# EAGLE design lcdpanel (EAGLE 6.4)
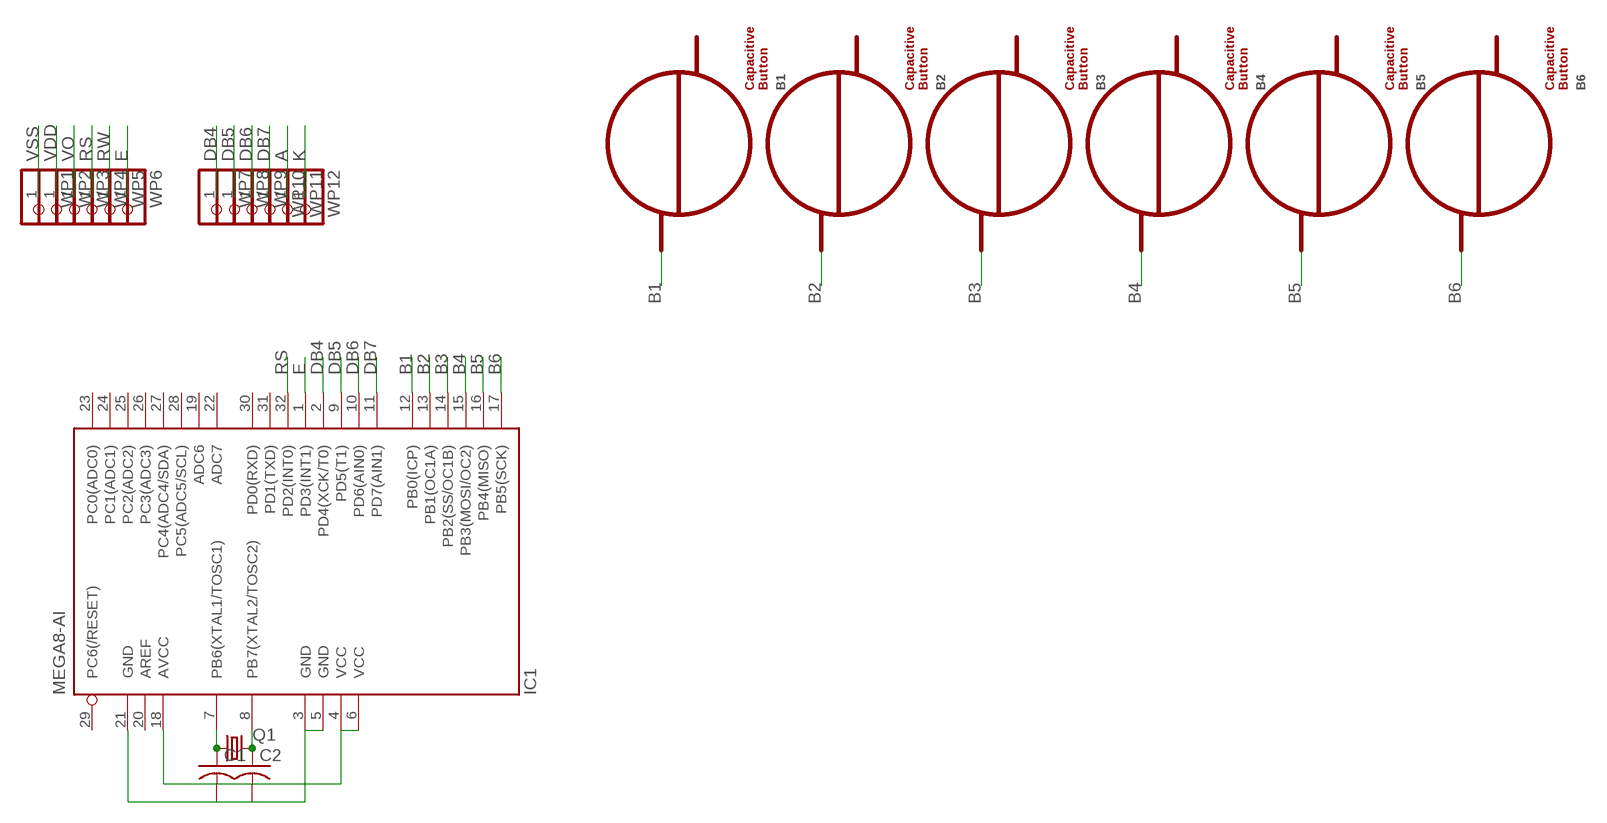
[diagram p0: schematic, sheet 1]

## Parts
B1  BUTTON_ACTIVE_DUAL  [BUTTON_ACTIVE_DUAL_10MM]
B2  BUTTON_ACTIVE_DUAL  [BUTTON_ACTIVE_DUAL_10MM]
B3  BUTTON_ACTIVE_DUAL  [BUTTON_ACTIVE_DUAL_10MM]
B4  BUTTON_ACTIVE_DUAL  [BUTTON_ACTIVE_DUAL_10MM]
B5  BUTTON_ACTIVE_DUAL  [BUTTON_ACTIVE_DUAL_10MM]
B6  BUTTON_ACTIVE_DUAL  [BUTTON_ACTIVE_DUAL_10MM]
C1  C-USC1206  [C1206]
C2  C-USC1206  [C1206]
IC1  MEGA8-AI  [TQFP32-08]
Q1  CRYSTALHC49UP  [HC49UP]
WP1  WPAD-1-0805  [WPAD-1-0805]
WP2  WPAD-1-0805  [WPAD-1-0805]
WP3  WPAD-1-0805  [WPAD-1-0805]
WP4  WPAD-1-0805  [WPAD-1-0805]
WP5  WPAD-1-0805  [WPAD-1-0805]
WP6  WPAD-1-0805  [WPAD-1-0805]
WP7  WPAD-1-0805  [WPAD-1-0805]
WP8  WPAD-1-0805  [WPAD-1-0805]
WP9  WPAD-1-0805  [WPAD-1-0805]
WP10  WPAD-1-0805  [WPAD-1-0805]
WP11  WPAD-1-0805  [WPAD-1-0805]
WP12  WPAD-1-0805  [WPAD-1-0805]

## Nets
A: WP11.1
B1: B1.Q2 IC1.12(PB0(ICP))
B2: B2.Q2 IC1.13(PB1(OC1A))
B3: B3.Q2 IC1.14(PB2(SS/OC1B))
B4: B4.Q2 IC1.15(PB3(MOSI/OC2))
B5: B5.Q2 IC1.16(PB4(MISO))
B6: B6.Q2 IC1.17(PB5(SCK))
DB4: IC1.2(PD4(XCK/T0)) WP7.1
DB5: IC1.9(PD5(T1)) WP8.1
DB6: IC1.10(PD6(AIN0)) WP9.1
DB7: IC1.11(PD7(AIN1)) WP10.1
E: IC1.1(PD3(INT1)) WP6.1
K: WP12.1
N$1: C2.1 IC1.8(PB7(XTAL2/TOSC2)) Q1.2
N$2: C1.1 IC1.7(PB6(XTAL1/TOSC1)) Q1.1
N$3: C1.2 C2.2 IC1.3(GND) IC1.5(GND) IC1.21(GND)
N$4: IC1.4(VCC) IC1.6(VCC) IC1.18(AVCC)
RS: IC1.32(PD2(INT0)) WP4.1
RW: WP5.1
VDD: WP2.1
VO: WP3.1
VSS: WP1.1
Unconnected: B1.Q1 B2.Q1 B3.Q1 B4.Q1 B5.Q1 B6.Q1 IC1.19(ADC6) IC1.20(AREF) IC1.22(ADC7) IC1.23(PC0(ADC0)) IC1.24(PC1(ADC1)) IC1.25(PC2(ADC2)) IC1.26(PC3(ADC3)) IC1.27(PC4(ADC4/SDA)) IC1.28(PC5(ADC5/SCL)) IC1.29(PC6(/RESET)) IC1.30(PD0(RXD)) IC1.31(PD1(TXD))

## Library data of the parts
B1-B6 = PatternAgents-TouchWidgets:BUTTON_ACTIVE_DUAL: Button, Active Capacitive/Touch Sensing Type, Dual Source : http://www.PatternAgents.com Github : https://github.com/PatternAgents License : http://creativecommons.org/licenses/by-sa/3.1/ (Creative Commons 3.1) THIS SOFTWARE IS PROVIDED BY THE CONTRIBUTORS "AS IS" AND WITHOUT ANY EXPRESS OR IMPLIED WARRANTIES, INCLUDING, BUT NOT LIMITED TO, THE IMPLIED WARRANTIES OF MERCHANTABILITY AND FITNESS FOR A PARTICULAR PURPOSE ARE DISCLAIMED. IN NO EVENT SHALL THE COPYRIGHT OWNER OR CONTRIBUTORS BE LIABLE FOR ANY DIRECT, INDIRECT, INCIDENTAL, SPECIAL, EXEMPLARY, OR CONSEQUENTIAL DAMAGES (INCLUDING, BUT NOT LIMITED TO, PROCUREMENT OF SUBSTITUTE GOODS OR SERVICES; LOSS OF USE, DATA, OR PROFITS; OR BUSINESS INTERRUPTION) HOWEVER CAUSED AND ON ANY THEORY OF LIABILITY, WHETHER IN CONTRACT, STRICT LIABILITY, OR TORT (INCLUDING NEGLIGENCE OR OTHERWISE) ARISING IN ANY WAY OUT OF THE USE OF THIS SOFTWARE, EVEN IF ADVISED OF THE POSSIBILITY OF SUCH DAMAGE.
C1 C2 = adafruit:C-US: CAPACITOR, American symbol
IC1 = atmel:MEGA8: MICROCONTROLLER 8 Kbytes FLASH, 1 kbytes SRAM, 512 bytes EEPROM, USART, 6-channel 10 bit ADC, 2-channel 8 bit ADC Pin compatible with Atmega48, ATMega88, ATMega168 Source: avr.lbr; MPN: ATMEGA8-16AU; OC_FARNELL: 9171371; OC_NEWARK: 73M8863
Q1 = adafruit:CRYSTAL: CRYSTAL; OC_FARNELL: unknown; OC_NEWARK: unknown
WP1-WP12 = PatternAgents-ProtoPads:WPAD-1: Wire Pad - Single Good for scope lead clips, test jumpers, probe points, etc. PatternAgents ProtoPads Library Schematic and PCB layout libraries for design patterns by PatternAgents. For the CADSoft Eagle CAD program : http://www.cadsoftusa.com/download-eagle/ Source LBR : http://www.patternagents.com Github : https://github.com/PatternAgents License : http://creativecommons.org/licenses/by-sa/4.0/ (Creative Commons 4.0) THIS SOFTWARE IS PROVIDED BY THE CONTRIBUTORS "AS IS" AND WITHOUT ANY EXPRESS OR IMPLIED WARRANTIES, INCLUDING, BUT NOT LIMITED TO, THE IMPLIED WARRANTIES OF MERCHANTABILITY AND FITNESS FOR A PARTICULAR PURPOSE ARE DISCLAIMED. IN NO EVENT SHALL THE COPYRIGHT OWNER OR CONTRIBUTORS BE LIABLE FOR ANY DIRECT, INDIRECT, INCIDENTAL, SPECIAL, EXEMPLARY, OR CONSEQUENTIAL DAMAGES (INCLUDING, BUT NOT LIMITED TO, PROCUREMENT OF SUBSTITUTE GOODS OR SERVICES; LOSS OF USE, DATA, OR PROFITS; OR BUSINESS INTERRUPTION) HOWEVER CAUSED AND ON ANY THEORY OF LIABILITY, WHETHER IN CONTRACT, STRICT LIABILITY, OR TORT (INCLUDING NEGLIGENCE OR OTHERWISE) ARISING IN ANY WAY OUT OF THE USE OF THIS SOFTWARE, EVEN IF ADVISED OF THE POSSIBILITY OF SUCH DAMAGE.; BOM: EXCLUDE

## Board
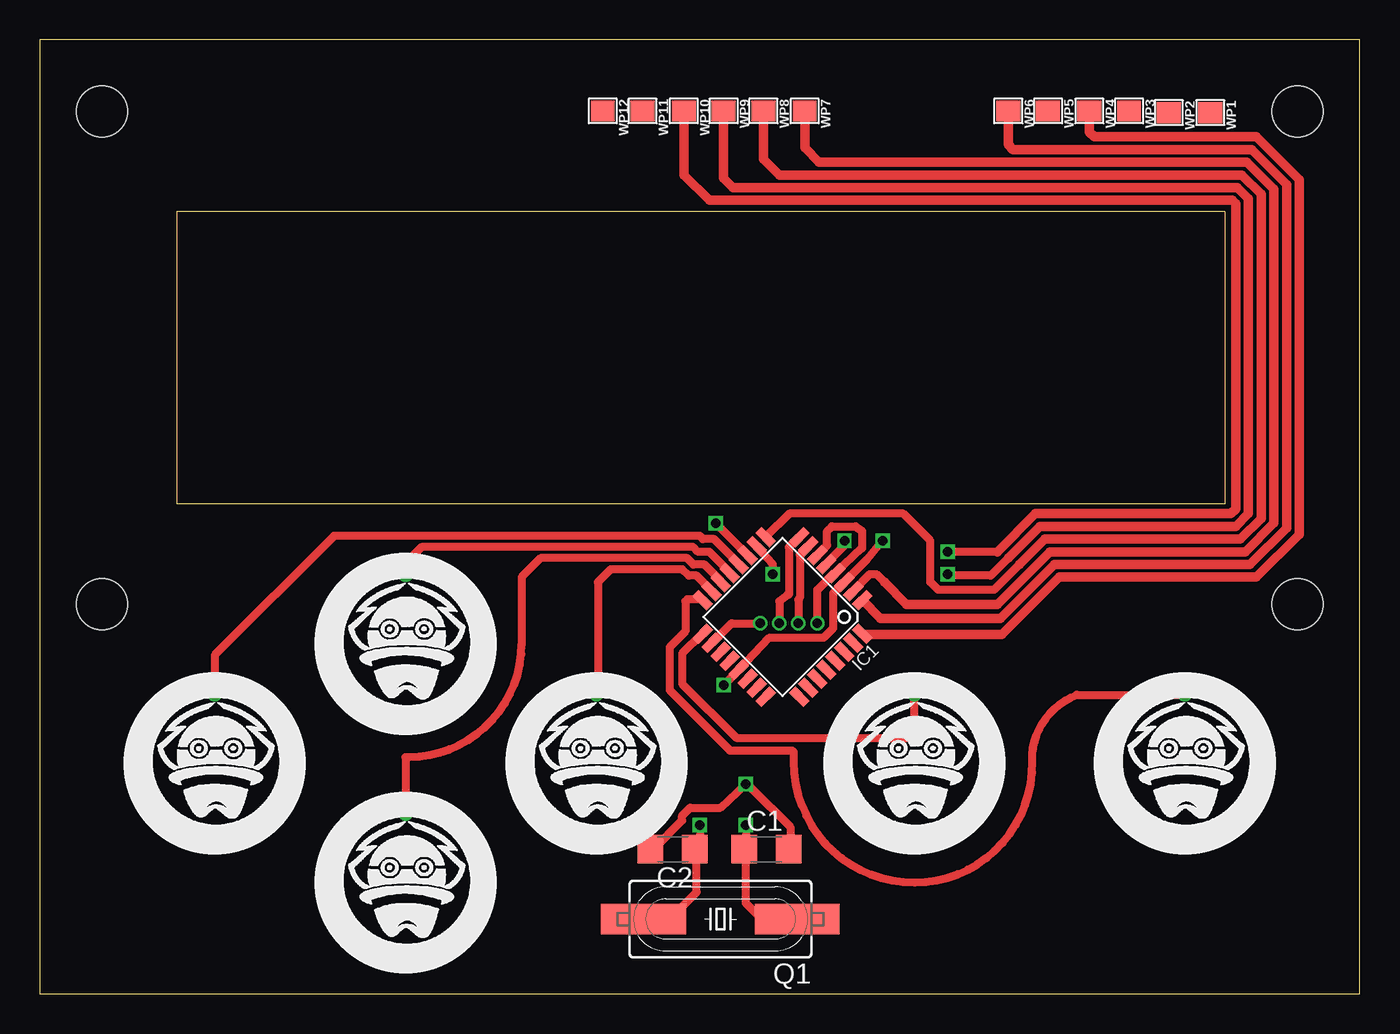
[diagram p1: board, top side]
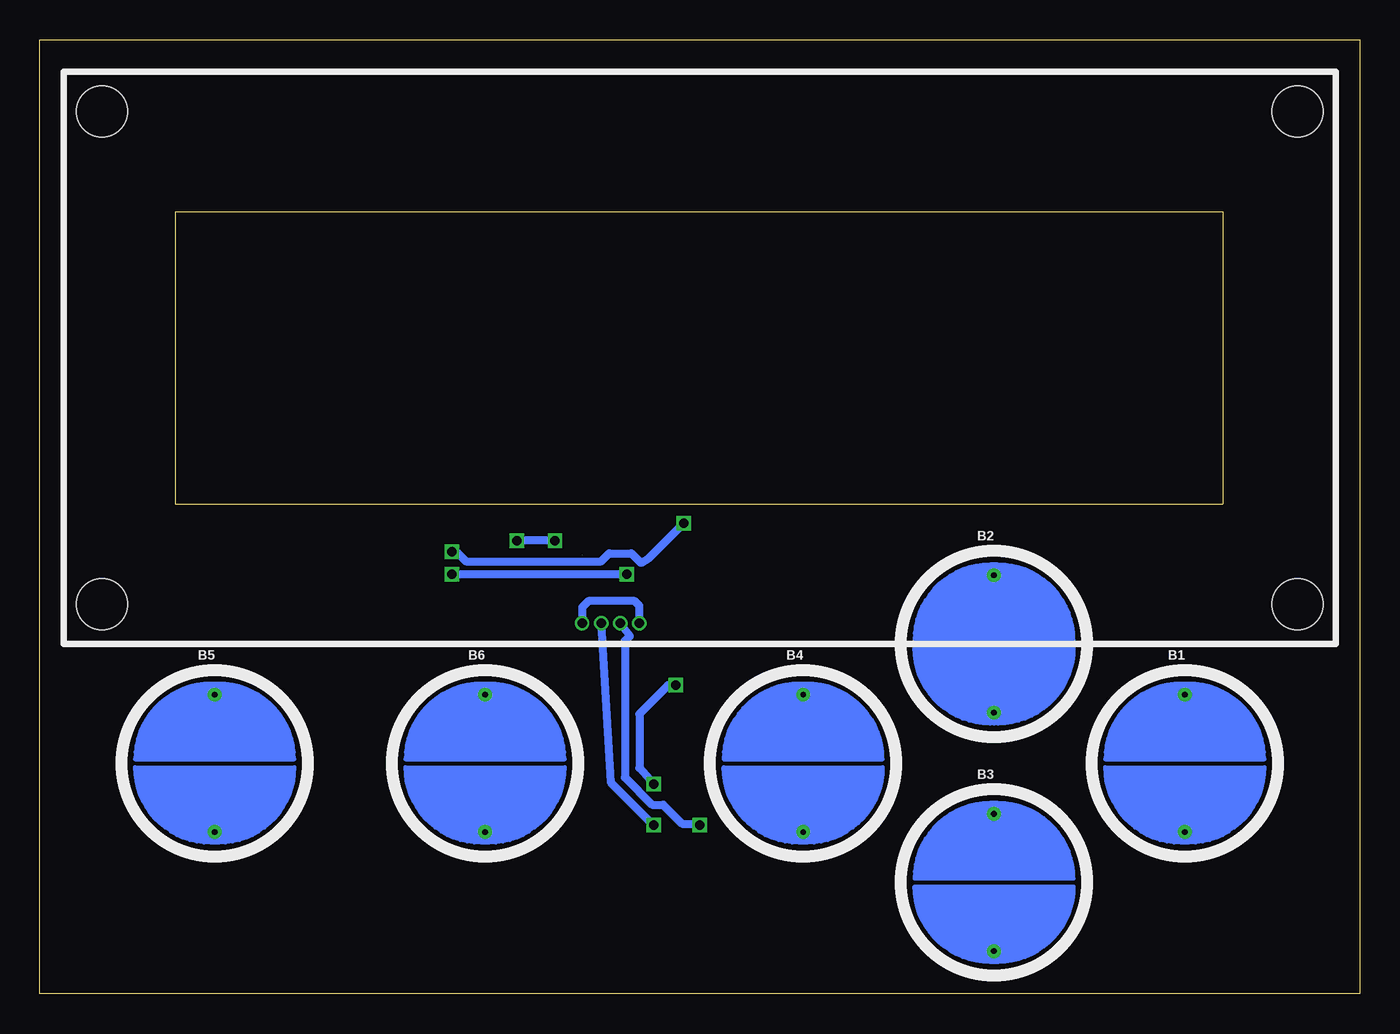
[diagram p2: board, bottom side, seen from below]

Size 83 x 60 mm. Coordinates in mm from the lower left corner, seen from the top.
Outline: 0,0 83,0 83,60 0,60 0,0
Outline: 74.5,30.8 8.6,30.8 8.6,49.2 74.5,49.2 74.5,30.8
Copper layers (1*16): Top 0.035mm / dielectric 1.5mm / Bottom 0.035mm
Design rules "dirt_cheap_dirty_boards.v1": minimum track width 5mil, minimum drill 12mil, track to track 5mil, track to pad 5mil, pad to pad 5mil, via to via 5mil, smd to smd 0mil, copper to edge 10mil, drill to drill 10mil, minimum pad ring 10mil, minimum via ring 6mil, stop-mask expansion 2mil, vias tented up to drill 25mil, thermal gap 10mil
Holes 3.2 mm at 3.9,55.5 79.1,55.5 79.1,24.5 3.9,24.5

### Footprints (pad centres in the part's own frame; a part is rotated, then mirrored left to right if it is on the bottom)
BUTTON_ACTIVE_DUAL_10MM = drill 0.356: Q1 0,4.318; Q2 0,-4.318
C1206 = smd 1.6 x 1.8: 1 -1.4,0; 2 1.4,0
TQFP32-08 = smd 1.27 x 0.559: 1 -4.293,2.8; 2 -4.293,2; 3 -4.293,1.2; 4 -4.293,0.4; 5 -4.293,-0.4; 6 -4.293,-1.2; 7 -4.293,-2; 8 -4.293,-2.8; 17 4.293,-2.8; 18 4.293,-2; 19 4.293,-1.2; 20 4.293,-0.4; 21 4.293,0.4; 22 4.293,1.2; 23 4.293,2; 24 4.293,2.8 | smd 0.559 x 1.27: 9 -2.8,-4.293; 10 -2,-4.293; 11 -1.2,-4.293; 12 -0.4,-4.293; 13 0.4,-4.293; 14 1.2,-4.293; 15 2,-4.293; 16 2.8,-4.293; 25 2.8,4.293; 26 2,4.293; 27 1.2,4.293; 28 0.4,4.293; 29 -0.4,4.293; 30 -1.2,4.293; 31 -2,4.293; 32 -2.8,4.293
HC49UP = smd 5.334 x 1.93: 1 -4.826,0; 2 4.826,0
WPAD-1-0805 = smd 1.3 x 1.5: 1 -0.015,0

### Placement (x,y rotation side)
B1  11,14.5 180 bottom
B2  23,22 180 bottom
B3  23,7 180 bottom
B4  35,14.5 180 bottom
B5  72,14.5 180 bottom
B6  55,14.5 180 bottom
C1  45.7,9.1 0 top
C2  39.8,9.1 180 top
IC1  46.7,23.7 225 top
Q1  42.8,4.7 180 top
WP1  73.6,55.4 270 top
WP2  71,55.4 270 top
WP3  68.5,55.5 270 top
WP4  66,55.5 270 top
WP5  63.4,55.5 270 top
WP6  60.9,55.5 270 top
WP7  48.1,55.5 270 top
WP8  45.5,55.5 270 top
WP9  43,55.5 270 top
WP10  40.5,55.5 270 top
WP11  37.9,55.5 270 top
WP12  35.4,55.5 270 top

### Tracks (layer width: path | path; a pad name or v marks a point on that pad's centre or on a via)
B1
  Top 0.5: IC1.12 43.95,27.05 42.4,28.6 41.7,28.6 41.5,28.8 18.5,28.8 11,21.3 B1.Q2
B2
  Top 0.5: IC1.13 43.38,26.52 42.1,27.8 41.4,27.8 41.1,28.1 24,28.1 23,27.1 B2.Q2
B3
  Top 0.5: IC1.14 42.82,25.98 41.8,27 41.1,27 40.7,27.4 31.5,27.4 30.3,26.2 30.3,22 arc-90 23.2,14.9 23,14.9 B3.Q2
B4
  Top 0.5: IC1.15 42.25,25.35 41.3,26.3 40.8,26.3 40.4,26.7 35.9,26.7 35.1,25.9 35.1,18.92 B4.Q2
B5
  Top 0.5: IC1.16 41.69,24.82 40.72,24.82 40.6,24.7 40.6,22.8 39.6,21.8 39.6,19.1 43.4,15.3 47.3,15.3 47.4,15.2 47.4,14.6 arc90 55,7 arc92 62.4,14.6 arc-70 65.2,18.8 72,18.8 B5.Q2 71.98,18.8
B6
  Top 0.5: IC1.17 41.65,22.64 40.4,21.4 40.4,19.5 43.8,16.1 54.6,16.1 55,16.5 B6.Q2
DB4
  Top 0.5: IC1.2 51.15,25.35 52.2,26.4 52.6,26.4 53.1,25.9
  Top 0.61: WP7.1 48.1,53.2 49,52.3 75.9,52.3 77.6,50.6 77.6,29.6 75.8,27.8 63.5,27.8 60.2,24.5 54.5,24.5 53.1,25.9
DB5
  Top 0.5: 61.6,27 60,25.4 56.5,25.4 56,25.9 56,28.5 54.3,30.2 47.13,30.2 IC1.9
  Top 0.61: WP8.1 45.5,52.5 46.5,51.5 75.6,51.5 76.8,50.3 76.8,29.9 75.5,28.6 63.2,28.6 61.6,27
DB6  (via drill 0.6)
  Top 0.5: 60.9,27.4 59.8,26.3 57.2,26.3 v57.1,26.4 | v46.1,26.4 46.1,27.03 IC1.10
  Top 0.61: WP9.1 43,51.3 43.6,50.7 75.3,50.7 76,50 76,30.2 75.2,29.4 62.9,29.4 60.9,27.4
  Bottom 0.5: v57.1,26.4 v46.1,26.4
DB7  (via drill 0.6)
  Top 0.5: 60.2,27.8 v57.1,27.8 | v42.5,29.6 43.5,28.6 IC1.11
  Top 0.61: WP10.1 40.5,51.5 42.1,49.9 75,49.9 75.2,49.7 75.2,30.5 74.9,30.2 62.6,30.2 60.2,27.8
  Bottom 0.5: v57.1,27.8 56.8,27.8 56.2,27.2 47.7,27.2 47.2,27.7 45.8,27.7 45.2,27.1 44.7,27.4 v42.5,29.6
E
  Top 0.61: WP6.1 60.9,53.4 61.2,53.1 76.2,53.1 78.4,50.9 78.4,29.3 76.1,27 63.8,27 60.4,23.6 52.87,23.6 IC1.1
N$1  (via drill 0.6)
  Top 0.5: IC1.8 47.72,28.71 47.1,28.1 47.1,25.1 47,25.1 46.5,24.7 v46.5,23.3 | v41.5,10.6 41.5,9.6 C2.1 41.3,9 41.3,6.4 39.6,4.7 Q1.2
  Bottom 0.5: v46.5,23.3 45.9,22.5 46.2,22.2 46.2,13.6 44.5,11.9 43.8,11.9 42.6,10.7 41.6,10.7 v41.5,10.6
N$2  (via drill 0.6)
  Top 0.5: IC1.7 48.32,28.12 47.8,27.6 47.8,24.9 47.7,24.8 v47.7,23.3 | v44.4,10.6 44.4,9.2 C1.1 44.4,9 44.4,5.7 45.4,4.7 Q1.1
  Bottom 0.5: v47.7,23.3 47.1,13.3 v44.4,10.6
N$3  (via drill 0.6)
  Top 0.5: IC1.5 49.45,27.05 50.6,28.2 v50.6,28.5 | v53,28.5 52,27.3 IC1.3 49.9,25.2 49.9,23 49.3,22.4 45.9,22.4 43.98,20.38 IC1.21 43.95,20.35 v43,19.4 | C1.2 47.2,9.2 47.2,10.5 44.7,13 v44.4,13.2 42.8,11.7 40.9,11.7 40.4,11.2 40.4,10.9 38.6,9.1 C2.2
  Bottom 0.5: v50.6,28.5 v53,28.5 | v43,19.4 43.5,19.4 45.3,17.6 45.3,14.2 v44.4,13.2
N$4  (via drill 0.6)  (1 unrouted)
  Top 0.5: IC1.18 42.28,22.08 43.5,23.3 v45.3,23.3 | v48.9,23.3 48.9,25.4 49.95,26.45 IC1.4 51.7,28.03 51.7,29.1 51.3,29.4 49.8,29.4 49.5,29.1 49.5,28.2 IC1.6
  Bottom 0.5: v45.3,23.3 45.3,24.4 45.6,24.7 48.5,24.7 48.9,24.3 v48.9,23.3
RS
  Top 0.61: WP4.1 66,54.2 66.3,53.9 76.5,53.9 79.2,51.2 79.2,28.9 76.5,26.2 64.1,26.2 60.5,22.6 51.76,22.6 IC1.32